# Altium schematic sheet Gate_Driver_Connection.SchDoc
size A; SheetNumber: 2; SheetTotal: 2
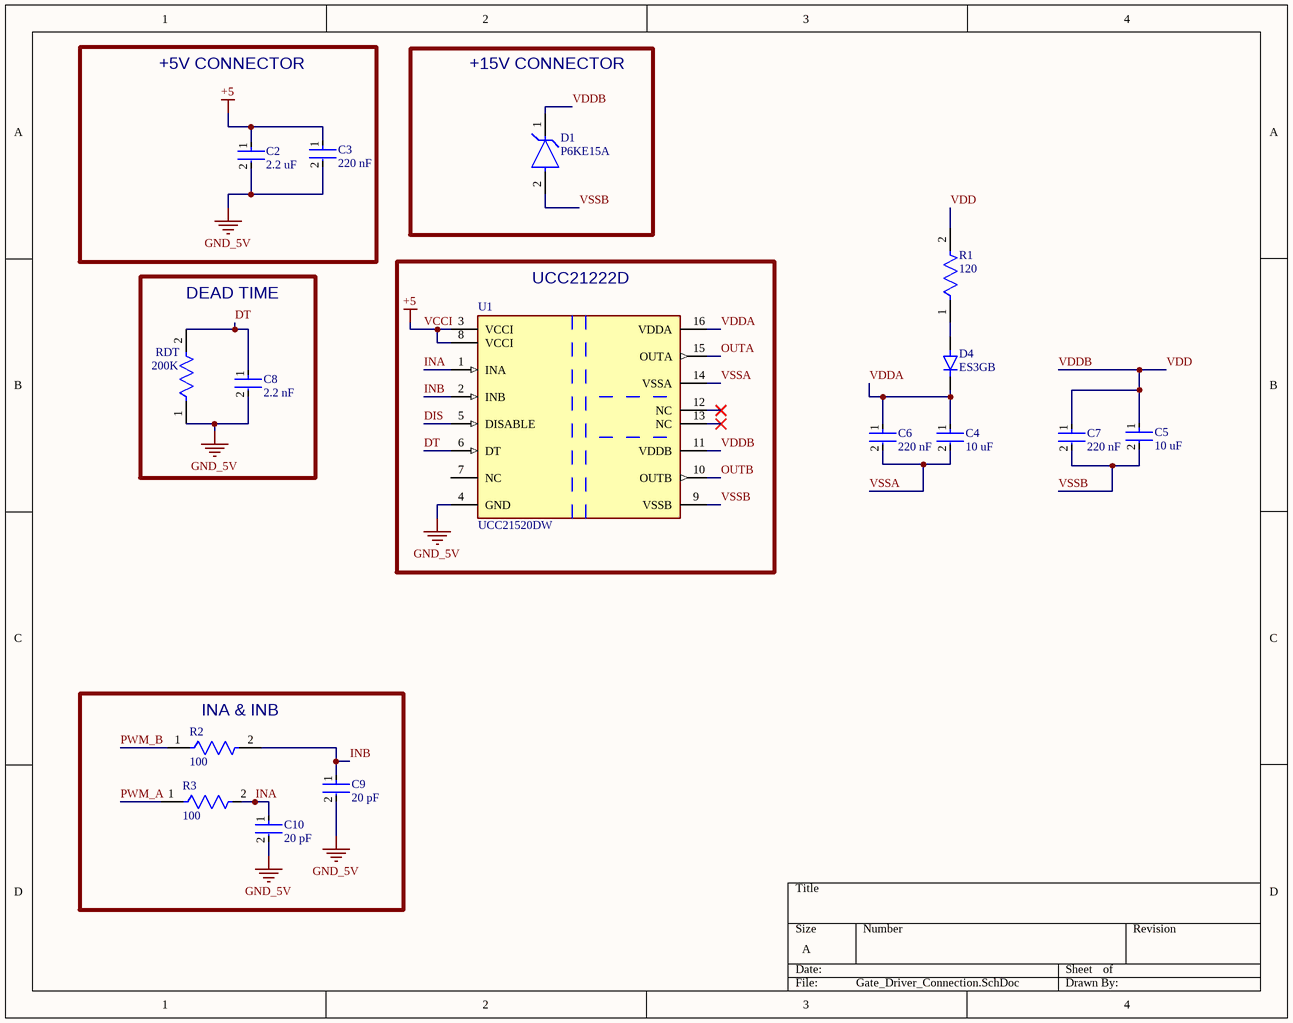
[diagram p0: Gate_Driver_Connection.SchDoc]

## Parts
C2  2.2 uF  [FP-C0805C-DN-MFG]
C3  220 nF  [FP-C0805C-DN-MFG]
C4  10 uF  [FP-C0805C-DN-MFG]
C5  10 uF  [FP-C0805C-DN-MFG]
C6  220 nF  [FP-C0805C-DN-MFG]
C7  220 nF  [FP-C0805C-DN-MFG]
C8  2.2 nF  [FP-C0805C-DN-MFG]
C9  20 pF  [FP-C0805C-DN-MFG]
C10  20 pF  [FP-C0805C-DN-MFG]
D1  P6KE15A  [FP-DO-15-MFG]
D4  ES3GB  [DIOM4336X265N]
R1  120  [FP-RC0805-0_6-IPC_C]
R2  100  [FP-RC0805-0_6-IPC_C]
R3  100  [FP-RC0805-0_6-IPC_C]
RDT  200K  [FP-CF18-MFG]
U1  UCC21520DW  [FP-DW0016B-MFG]

## Blocks framed on the sheet
+5V CONNECTOR: C2 C3
+15V CONNECTOR: D1
DEAD TIME: C8 RDT
UCC21222D: U1
INA & INB: C9 C10 R2 R3

## Nets
GND_5V: C2.2 C3.2 C8.2 C9.2 C10.2 RDT.1 U1.4(GND)
VCCI: C2.1 C3.1 U1.3(VCCI) U1.8(VCCI)  [also labelled +5]
DIS: U1.5(DISABLE)
DT: C8.1 RDT.2 U1.6(DT)
INA: C10.1 R3.2 U1.1(INA)
INB: C9.1 R2.2 U1.2(INB)
OUTA: U1.15(OUTA)
OUTB: U1.10(OUTB)
PWM_A: R3.1
PWM_B: R2.1
VDD: C5.1 C7.1 D1.1(C) R1.2 U1.11(VDDB)  [also labelled VDDB]
VDDA: C4.1 C6.1 D4.C(K) U1.16(VDDA)
VSSA: C4.2 C6.2 U1.14(VSSA)
VSSB: C5.2 C7.2 D1.2(A) U1.9(VSSB)
NetD4_A: D4.A R1.1

Not connected (* = marked no-connect by the designer): U1 7(NC) 12(NC)* 13(NC)*

## Library data of the parts
C2-C10 = CMP-1036-04552-2: CAP CER 0.22UF 50V X7R 0805; Manufacturer: KEMET; Manufacturer Part Number: C0805C224K5RACTU; Value: 0.22 μF; Temperature Coefficient: 30ppm/°C; Material: Ceramic; Tolerance: 0.1; ComponentLink2URL: https://content.kemet.com/datasheets/KEM_C1003_C0G_SMD.pdf; Temperature Characteristic: X7R; Device Class L3: Ceramic Capacitors; Lead Free: Yes; Temperature: -55°C to +125°C; RoHS: TRUE; Capacitance: 0.22 μF; Automotive: No; Octopart: https://octopart.com/c0805c224k5ractu-kemet-144670; Temperature Range Low: -55°C; Height: 0.88mm; Device Class L1: Passive Components; Digikey Description: CAP CER 0.22UF 50V X7R 0805; ComponentLink2Description: Datasheet; Mouser Description: CAP CER 0.22UF 50V X7R 0805; Category: Cap; Ipc Land Pattern Name: CAPC200125X78; Temperature Range High: +125°C; Package: C0805C-DN; Device Class L2: Capacitors; Voltage Rating: 50 V
D1 = CMP-00278-00112159-1: P6KE15A 600 Watt SUR40 Transient Voltage Suppressor, 15 V, Unidirectional; NexarPartId: 112159; Element Configuration: Single; Number of Channels: 1; Power Rating: 600W; Power Line Protection: No; Max Surge Current: 28A; Clamping Voltage: 21.2V; Capacitance: 1.6pF; Max Breakdown Voltage: 15.8V; Breakdown Voltage: 14.3V; Reverse Standoff Voltage: 12.8V; Voltage Rating (DC): 15V; Leakage Current: 5µA; Test Current: 1mA; Max Operating Temperature: 150°C; Packaging: Bulk; Case/Package: DO-15; Mount: Through Hole; Number of Elements: 1; Max Power Dissipation: 600W; Radiation Hardening: No; Diameter: 3.56mm; Peak Pulse Current: 28A; Peak Pulse Power: 600W; Length: 6.75mm; Lead Free: Lead Free; Min Operating Temperature: -55°C; Polarity: Unidirectional; Composition: Zener; Current Rating: 28A; Termination: Axial; ESD Protection: No; Height: 3.56mm; REACH SVHC: No SVHC; Weight: 300mg; RoHS: Compliant; Number of Unidirectional Channels: 1; Number of Pins: 2; Operating Supply Voltage: 12.8V; Min Breakdown Voltage: 14.3V; Direction: Unidirectional; Max Reverse Leakage Current: 5µA; Reverse Breakdown Voltage: 14.3V; Power Dissipation: 600W; Width: 3.56mm
D4 = ES3GB: MF: {'manufacturer': u'Taiwan Semiconductor'}; Package: None; Price: None; Value: *; MP: ES3GB; Availability: Unavailable
R1-R3 = CMP-2100-03668-5: RES 100K OHM 1% 1/8W 0805; Power Rating: 125mW; Temperature Coefficient: 100ppm/°C; Voltage Rating (DC): 150V; Resistance: 100kR; Package Quantity: 1; Case/Package: 0805; Lead Pitch: 0.4mm; Case Code (Imperial): 0805; Construction: Rectangular; Number of Terminations: 2; RoHS Compliant: Yes; Max Power Dissipation: 125mW; Tolerance: 1%; Max Operating Temperature: 155°C; Resistance Tolerance: 1%; Lead Free: Lead Free; Packaging: Tape and Reel; Resistor Type: Thick Film; Min Operating Temperature: -55°C; Case Code (Metric): 2012; Series: RC; Technology: THICK FILM; Voltage Rating: 150V; Termination: SMD/SMT; Width: 0.049inch; Number of Pins: 2; Features: Moisture Resistant; Military Standard: Not; Length: 0.079inch; Depth: 1.25mm; Size Code: 0805; Height: 0.024inch
RDT = CMP-26528-000002-1: RES 10K OHM 1/8W 5% CF AXIAL; Manufacturer Part Number: CF18JT10K0; Manufacturer: Stackpole Electronics; Power Rating: 0.125W; Temperature Coefficient: 0-500ppm/°C; Resistance: 10kΩ; Voltage Rating: 250V; Value: 10kΩ; Temperature: -55°C to +155°C; Height: 2mm; Lead Free: Yes; Automotive: No; Device Class L2: Resistors; Package: CF18; Series: CF; ComponentLink2Description: Datasheet; Ipc Land Pattern Name: RESAD656W65L360D200; Temperature Range High: +155°C; RoHS: TRUE; Device Class L3: Through-Hole Resistors; Temperature Range Low: -55°C; Device Class L1: Passive Components; Category: Res; Octopart: https://octopart.com/cf18jt10k0-stackpole+electronics-19205642; Composition: Carbon Film; Digikey Description: RES 10K OHM 1/8W 5% CF AXIAL; ComponentLink2URL: http://www.seielect.com/Catalog/SEI-CF_CFM.pdf; Tolerance: 5%
U1 = CMP-04912-000047-1: DGTL ISO 5.7KV GATE DRVR 16SOIC; Number of Channels: 2; Max Output Current: 6A; Min Supply Voltage: 6.5V; Working Voltage: 2.121kV; Max Supply Voltage: 25V; Max Operating Temperature: 125°C; REACH SVHC: No SVHC; Case/Package: SOIC; Min Operating Temperature: -40°C; Number of Pins: 16; Lead Free: Lead Free